# EAGLE design brewpi (EAGLE 7.1.0)
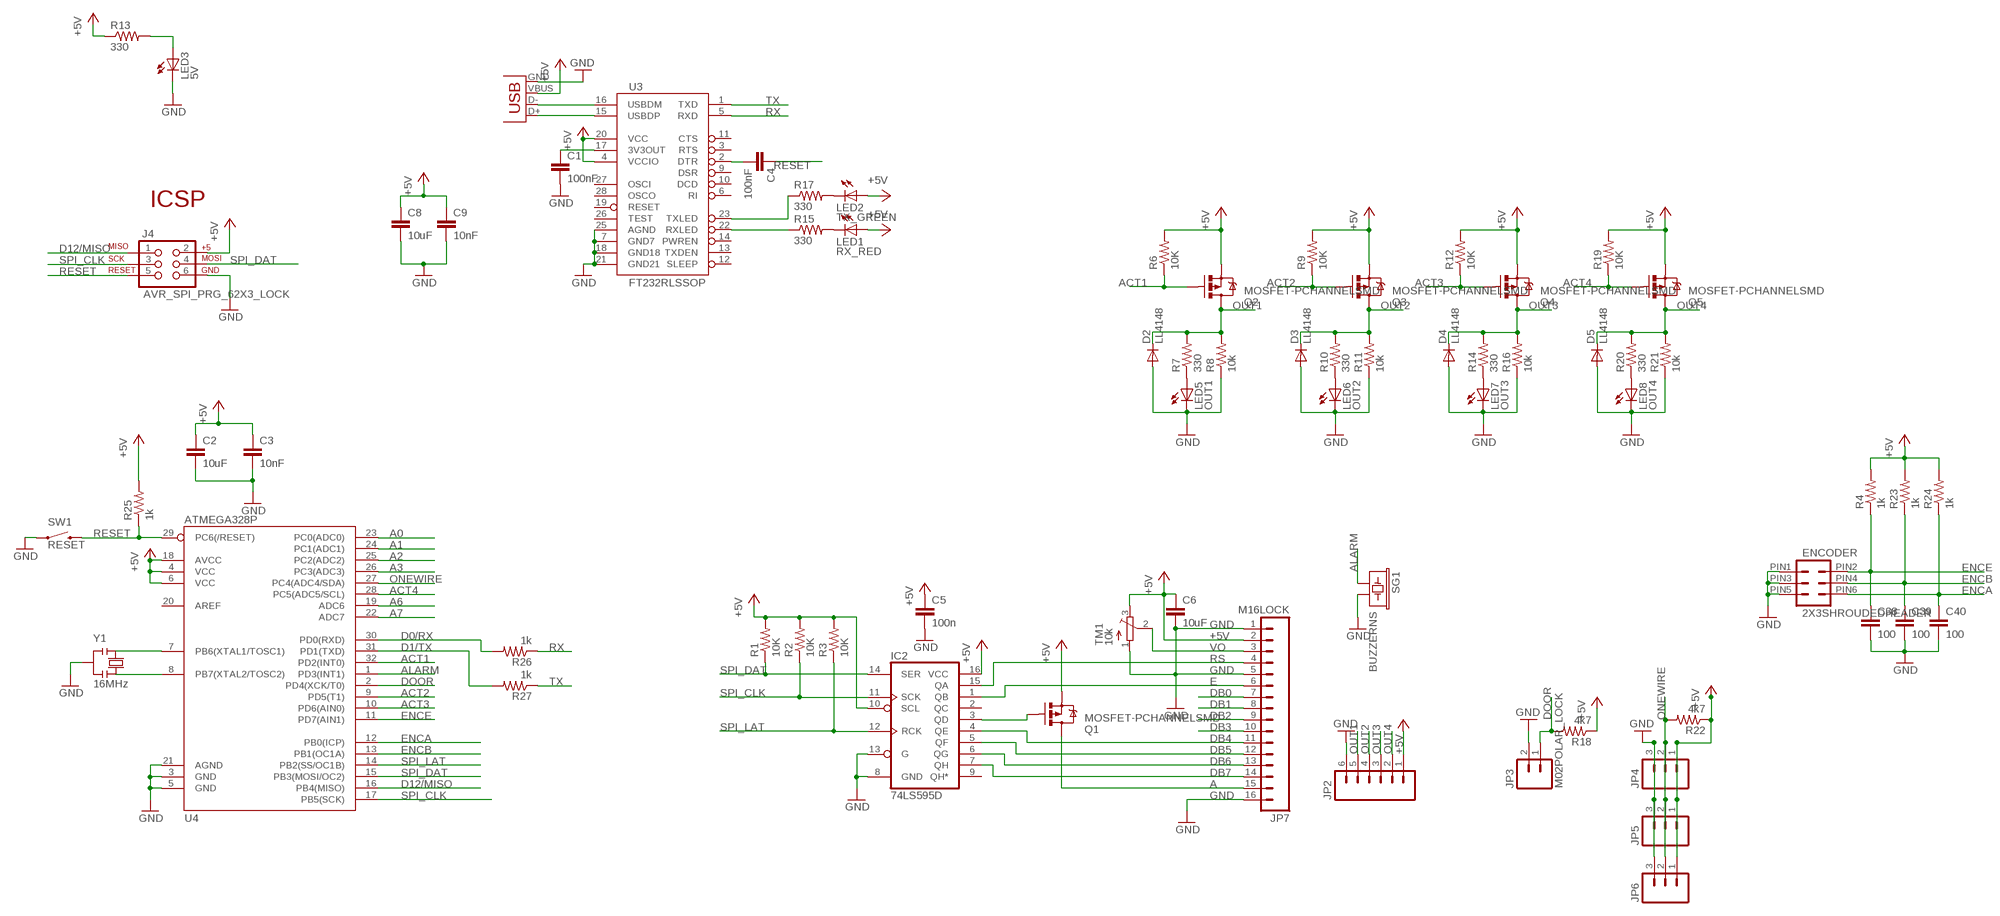
[diagram p0: schematic, sheet 1]

## Parts
C1  100nF  CAP0603-CAP  [0603-CAP]
C2  10uF  CAP0603-CAP  [0603-CAP]
C3  10nF  CAP0603-CAP  [0603-CAP]
C4  100nF  CAP0603-CAP  [0603-CAP]
C5  100n  CAP0603-CAP  [0603-CAP]
C6  10uF  CAP0603-CAP  [0603-CAP]
C8  10uF  CAP0603-CAP  [0603-CAP]
C9  10nF  CAP0603-CAP  [0603-CAP]
C38  100  CAP0603-CAP  [0603-CAP]
C39  100  CAP0603-CAP  [0603-CAP]
C40  100  CAP0603-CAP  [0603-CAP]
D2  LL4148  [MLL34]
D3  LL4148  [MLL34]
D4  LL4148  [MLL34]
D5  LL4148  [MLL34]
ENCODER  2X3SHROUDEDHEADER  [2X3SHROUDEDHEADER]
IC2  74LS595D  [SO16]
J4  AVR_SPI_PRG_62X3_LOCK  [2X3_LOCK]
JP1  USBSMD  [USB-MINIB]
JP2  M06POLAR_LOCK  [MOLEX-1X6_LOCK]
JP3  M02POLAR_LOCK  [MOLEX-1X2_LOCK]
JP4  M03POLAR_LOCK  [MOLEX-1X3_LOCK]
JP5  M03POLAR_LOCK  [MOLEX-1X3_LOCK]
JP6  M03POLAR_LOCK  [MOLEX-1X3_LOCK]
JP7  M16LOCK  [1X16_LOCK]
LED1  RX_RED  LED0603  [LED-0603]
LED2  TX_GREEN  LED0603  [LED-0603]
LED3  5V  LED0603  [LED-0603]
LED5  OUT1  LED0603  [LED-0603]
LED6  OUT2  LED0603  [LED-0603]
LED7  OUT3  LED0603  [LED-0603]
LED8  OUT4  LED0603  [LED-0603]
Q1  MOSFET-PCHANNELSMD  [SOT23-3]
Q2  MOSFET-PCHANNELSMD  [SOT23-3]
Q3  MOSFET-PCHANNELSMD  [SOT23-3]
Q4  MOSFET-PCHANNELSMD  [SOT23-3]
Q5  MOSFET-PCHANNELSMD  [SOT23-3]
R1  10K  RESISTOR0603-RES  [0603-RES]
R2  10K  RESISTOR0603-RES  [0603-RES]
R3  10K  RESISTOR0603-RES  [0603-RES]
R4  1k  R-US_R0603  [R0603]
R6  10K  RESISTOR0603-RES  [0603-RES]
R7  330  RESISTOR0603-RES  [0603-RES]
R8  10k  RESISTOR0603-RES  [0603-RES]
R9  10K  RESISTOR0603-RES  [0603-RES]
R10  330  RESISTOR0603-RES  [0603-RES]
R11  10k  RESISTOR0603-RES  [0603-RES]
R12  10K  RESISTOR0603-RES  [0603-RES]
R13  330  RESISTOR0603  [0603-RES]
R14  330  RESISTOR0603-RES  [0603-RES]
R15  330  RESISTOR0603  [0603-RES]
R16  10k  RESISTOR0603-RES  [0603-RES]
R17  330  RESISTOR0603  [0603-RES]
R18  4k7  RESISTOR0603-RES  [0603-RES]
R19  10K  RESISTOR0603-RES  [0603-RES]
R20  330  RESISTOR0603-RES  [0603-RES]
R21  10k  RESISTOR0603-RES  [0603-RES]
R22  4k7  RESISTOR0603-RES  [0603-RES]
R23  1k  R-US_R0603  [R0603]
R24  1k  R-US_R0603  [R0603]
R25  1k  RESISTOR0603  [0603-RES]
R26  1k  RESISTOR0603  [0603-RES]
R27  1k  RESISTOR0603  [0603-RES]
SG1  BUZZERNS  [BUZZER-12MM-NS]
SW1  RESET  SWITCH-MOMENTARY-2SMD-4  [TACTILE_SWITCH_TALL]
TM1  10k  TRIMPOTTC33X  [TC33X]
U3  FT232RLSSOP  [SSOP28DB]
U4  ATMEGA328P  ATMEGA328_SMT  [TQFP32-08]
Y1  16MHz  RESONATORMU  [RESONATOR]

## Nets
+5V: C2.1 C3.1 C5.1 C6.1 C8.1 C9.1 IC2.10(SCL) IC2.16(VCC) J4.2 JP1.VBUS JP2.1 JP4.1 JP5.1 JP6.1 JP7.2 LED1.A LED2.A Q1.2(S) Q2.2(S) Q3.2(S) Q4.2(S) Q5.2(S) R1.2 R2.2 R3.2 R4.2 R6.2 R9.2 R12.2 R13.1 R18.1 R19.2 R22.1 R23.2 R24.2 R25.2 TM1.3(E) U3.4(VCCIO) U3.20(VCC) U4.4(VCC) U4.6(VCC) U4.18(AVCC)
A: JP7.15 Q1.3(D)
A0: U4.23(PC0(ADC0))
A1: U4.24(PC1(ADC1))
A2: U4.25(PC2(ADC2))
A3: U4.26(PC3(ADC3))
A6: U4.19(ADC6)
A7: U4.22(ADC7)
ACT1: Q2.1(G) R6.1 U4.32(PD2(INT0))
ACT2: Q3.1(G) R9.1 U4.9(PD5(T1))
ACT3: Q4.1(G) R12.1 U4.10(PD6(AIN0))
ACT4: Q5.1(G) R19.1 U4.28(PC5(ADC5/SCL))
ALARM: SG1.+ U4.1(PD3(INT1))
D0/RX: R26.2 U4.30(PD0(RXD))
D1/TX: R27.2 U4.31(PD1(TXD))
D12/MISO: J4.1 U4.16(PB4(MISO))
D_M: JP1.D- U3.16(USBDM)
D_P: JP1.D+ U3.15(USBDP)
DB0: JP7.7
DB1: JP7.8
DB2: JP7.9
DB3: JP7.10
DB4: IC2.4(QE) JP7.11
DB5: IC2.5(QF) JP7.12
DB6: IC2.6(QG) JP7.13
DB7: IC2.7(QH) JP7.14
DOOR: JP3.1 R18.2 U4.2(PD4(XCK/T0))
E: IC2.1(QB) JP7.6
ENCA: C40.1 ENCODER.PIN6 R24.1 U4.12(PB0(ICP))
ENCB: C39.1 ENCODER.PIN4 R23.1 U4.13(PB1(OC1A))
ENCE: C38.1 ENCODER.PIN2 R4.1 U4.11(PD7(AIN1))
GND: C1.2 C2.2 C3.2 C5.2 C6.2 C8.2 C9.2 C38.2 C39.2 C40.2 D2.A D3.A D4.A D5.A ENCODER.PIN1 ENCODER.PIN3 ENCODER.PIN5 IC2.8(GND) IC2.13(G) J4.6 JP1.GND JP2.6 JP3.2 JP4.3 JP5.3 JP6.3 JP7.1 JP7.5 JP7.16 LED3.C LED5.C LED6.C LED7.C LED8.C R8.1 R11.1 R16.1 R21.1 SG1.- SW1.A2 TM1.1(A) U3.7(GND7) U3.18(GND18) U3.21(GND21) U3.25(AGND) U4.3(GND) U4.5(GND) U4.21(AGND) Y1.2
N$1: U4.7(PB6(XTAL1/TOSC1)) Y1.1
N$2: U4.8(PB7(XTAL2/TOSC2)) Y1.3
N$3: LED3.A R13.2
N$4: C4.2 U3.2(DTR)
N$5: IC2.3(QD) Q1.1(G)
N$7: LED1.C R15.2
N$8: R15.1 U3.22(RXLED)
N$9: R17.1 U3.23(TXLED)
N$10: LED2.C R17.2
N$35: LED5.A R7.1
N$36: LED6.A R10.1
N$37: LED7.A R14.1
N$38: LED8.A R20.1
N$39: C1.1 U3.17(3V3OUT)
ONEWIRE: JP4.2 JP5.2 JP6.2 R22.2 U4.27(PC4(ADC4/SDA))
OUT1: D2.C JP2.5 Q2.3(D) R7.2 R8.2
OUT2: D3.C JP2.4 Q3.3(D) R10.2 R11.2
OUT3: D4.C JP2.3 Q4.3(D) R14.2 R16.2
OUT4: D5.C JP2.2 Q5.3(D) R20.2 R21.2
RESET: C4.1 J4.5 R25.1 SW1.B2 U4.29(PC6(/RESET))
RS: IC2.15(QA) JP7.4
RX: R26.1 U3.5(RXD)
SPI_CLK: IC2.11(SCK) J4.3 R2.1 U4.17(PB5(SCK))
SPI_DAT: IC2.14(SER) J4.4 R1.1 U4.15(PB3(MOSI/OC2))
SPI_LAT: IC2.12(RCK) R3.1 U4.14(PB2(SS/OC1B))
TX: R27.1 U3.1(TXD)
VO: JP7.3 TM1.2(S)
Unconnected: IC2.2(QC) IC2.9(QH*) U3.3(RTS) U3.6(RI) U3.9(DSR) U3.10(DCD) U3.11(CTS) U3.12(SLEEP) U3.13(TXDEN) U3.14(PWREN) U3.19(RESET) U3.26(TEST) U3.27(OSCI) U3.28(OSCO) U4.20(AREF)

## Notes on the sheet
- ICSP

## Library data of the parts
C1-C6 C8 C9 = SparkFun-Capacitors:CAP: Capacitor Standard 0603 ceramic capacitor, and 0.1" leaded capacitor.
C38-C40 = SparkFun:CAP: Capacitor Standard 0603 ceramic capacitor, and 0.1" leaded capacitor.
D2-D5 = Discrete:LL4148
ENCODER = personal:2X3SHROUDEDHEADER
IC2 = SparkFun-DigitalIC:74*595: 8-bit SHIFT REGISTER, output latch
J4 = SparkFun-Connectors:AVR_SPI_PRG_6: AVR ISP 6 Pin This is the reduced ISP connector for AVR programming. Common on Arduino. This footprint will take up less PCB space and can be used with a 10-pin to 6-pin adapter such as SKU: BOB-08508
JP1 = SparkFun-Connectors:USB: USB Connectors USB-B-PTH is fully proven SKU : PRT-00139/CONN-08278 USB-miniB is fully proven SKU : PRT-00587 USB-A-PCB is untested. USB-A-H is throughly reviewed, but untested. Spark Fun Electronics SKU : PRT-00437 USB-B-SMT is throughly reviewed, but untested. Needs silkscreen touching up. USB-A-S has not been used/tested USB-MB-H has not been used/tested USB-MICROB has been used. CONN-09505; PROD_ID: CONN-08193
JP2 = SparkFun-Connectors:M06: Header 6 Standard 6-pin 0.1" header. Use with straight break away headers (SKU : PRT-00116), right angle break away headers (PRT-00553), swiss pins (PRT-00743), machine pins (PRT-00117), and female headers (PRT-00115). Molex polarized connector foot print use with SKU : PRT-08094 with associated crimp pins and housings. NOTES ON THE VARIANTS LOCK and LOCK_LONGPADS... This footprint was designed to help hold the alignment of a through-hole component (i.e. 6-pin header) while soldering it into place. You may notice that each hole has been shifted either up or down by 0.005 of an inch from it's more standard position (which is a perfectly straight line). This slight alteration caused the pins (the squares in the middle) to touch the edges of the holes. Because they are alternating, it causes a "brace" to hold the component in place. 0.005 has proven to be the perfect amount of "off-center" position when using our standard breakaway headers. Although looks a little odd when you look at the bare footprint, once you have a header in there, the alteration is very hard to notice. Also,if you push a header all the way into place, it is covered up entirely on the bottom side. This idea of altering the position of holes to aid alignment will be further integrated into the Sparkfun Library for other footprints. It can help hold any component with 3 or more connection pins.
JP3 = SparkFun-Connectors:M02: Standard 2-pin 0.1" header. Use with - straight break away headers ( PRT-00116) - right angle break away headers (PRT-00553) - swiss pins (PRT-00743) - machine pins (PRT-00117) - female headers (PRT-00115) Molex polarized connector foot print use with: PRT-08233 with associated crimp pins and housings. 2.54_SCREWTERM for use with PRT-10571. 3.5mm Screw Terminal footprints for PRT-08084 5mm Screw Terminal footprints for use with PRT-08433
JP4-JP6 = SparkFun-Connectors:M03: Header 3 Standard 3-pin 0.1" header. Use with straight break away headers (SKU : PRT-00116), right angle break away headers (PRT-00553), swiss pins (PRT-00743), machine pins (PRT-00117), and female headers (PRT-00115). Molex polarized connector foot print use with SKU : PRT-08232 with associated crimp pins and housings.
JP7 = SparkFun-Connectors:M16: 1x16 .1" header
LED1-LED3 LED5-LED8 = SparkFun-LED:LED: LEDs Standard schematic elements and footprints for 5mm, 3mm, 1206, and 0603 sized LEDs. 5mm - Spark Fun Electronics SKU : COM-00529 (and others)
Q1-Q5 = SparkFun-DiscreteSemi:MOSFET-PCHANNEL: Generic PMOSFET
R1-R3 R6-R22 R25-R27 = SparkFun-Resistors:RESISTOR: Resistor Basic schematic elements and footprints for 0603, 1206, and PTH resistors.
R4 R23 R24 = rcl:R-US_: RESISTOR, American symbol
SG1 = SparkFun-Electromechanical:BUZZER: Buzzer 12mm Spark Fun Electronics SKU : Comp-Buzzer
SW1 = SparkFun-Electromechanical:SWITCH-MOMENTARY-2: Various NO switches- pushbuttons, reed, etc
TM1 = adafruit:TRIMPOT: SMT trimmer potentiometer part number TC33X http://www.ladyada.net/library/eagle
U3 = SparkFun-DigitalIC:FT232RL: USB UART FT232RL 4th Generation USB UART (USB <-> Serial) Controller. Spark Fun Electronics SKU : COM-00650 Production SKU IC-00870; PROD_ID: IC-00870
U4 = SparkFun-DigitalIC:ATMEGA328_SMT: 32-Pin Atmega328 part Commonly used on Arduino compatible boards Available in QFP and QFN packages TQFP is IC-09069 QFN is non-stock; PROD_ID: IC-09069
Y1 = MySMD2:RESONATOR

## Board
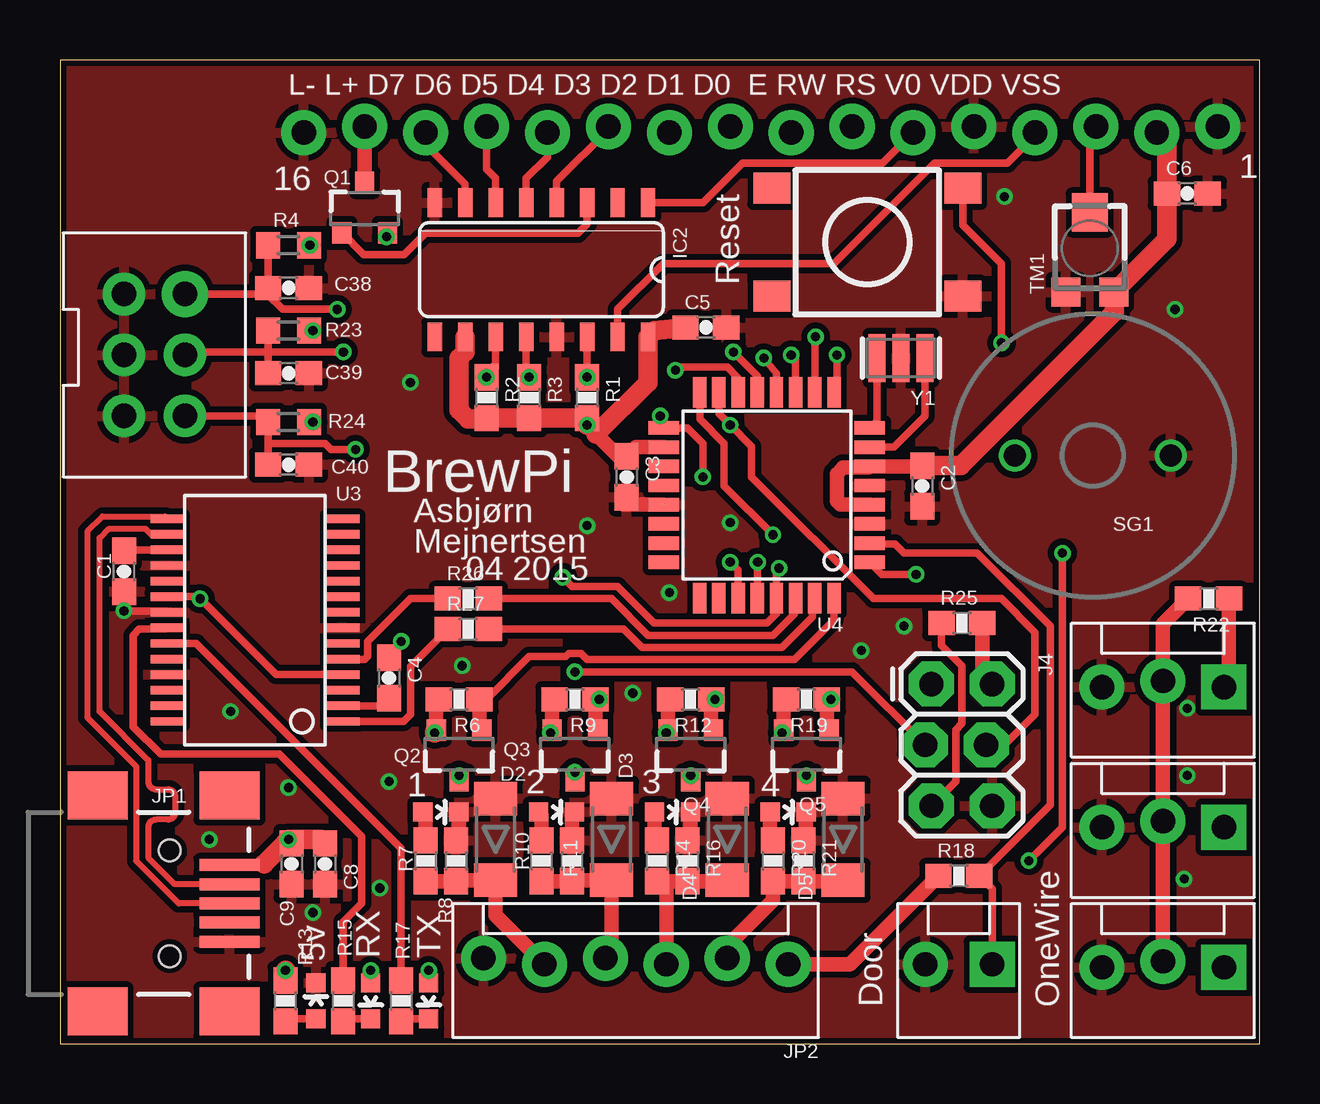
[diagram p1: board, top side]
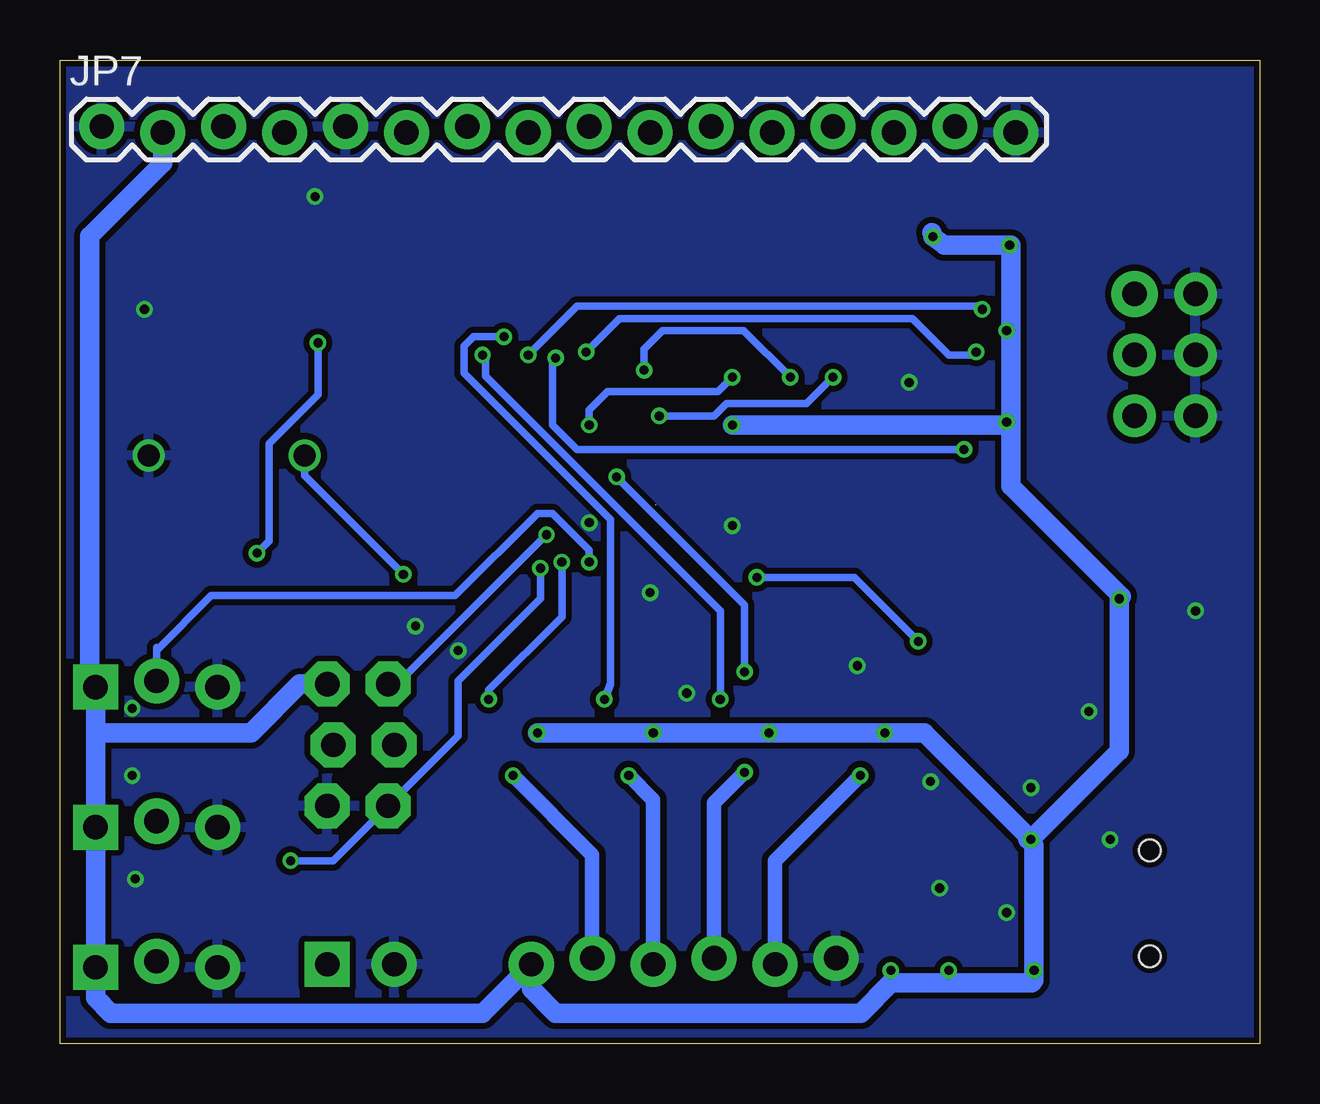
[diagram p2: board, bottom side, seen from below]

Size 50 x 41 mm. Coordinates in mm from the lower left corner, seen from the top.
Outline: 0,41 0,0 50,0 50,41 0,41
Copper layers (1*2*15*16): Top 0.035mm / dielectric 0.2mm / Route2 0.0175mm / dielectric 1.1mm / Route15 0.0175mm / dielectric 0.2mm / Bottom 0.035mm
Design rules "SeeedStudio_DRU_no_angle_20130527": minimum track width 6mil, minimum drill 12mil, track to track 6mil, track to pad 6mil, pad to pad 6mil, via to via 6mil, smd to smd 0mil, copper to edge 10mil, drill to drill 10mil, minimum pad ring 6mil, minimum via ring 6mil, stop-mask expansion 2mil, vias tented up to drill 25mil, thermal gap 10mil

### Footprints (pad centres in the part's own frame; a part is rotated, then mirrored left to right if it is on the bottom)
0603-CAP = smd 1.1 x 1: 1 -0.85,0; 2 0.85,0
MLL34 = smd 1.4 x 1.8: A 1.7,0; C -1.7,0
2X3SHROUDEDHEADER = drill 1.02 pad 1.778: PIN1 0,2.54; PIN3 2.54,2.54; PIN4 2.54,5.08; PIN5 5.08,2.54; PIN6 5.08,5.08 | drill 1.02 pad 1.93: PIN2 0,5.08
SO16 = smd 0.6 x 1.2: 1 -4.445,-2.8; 2 -3.175,-2.8; 3 -1.905,-2.8; 4 -0.635,-2.8; 5 0.635,-2.8; 6 1.905,-2.8; 7 3.175,-2.8; 8 4.445,-2.8; 9 4.445,2.8; 10 3.175,2.8; 11 1.905,2.8; 12 0.635,2.8; 13 -0.635,2.8; 14 -1.905,2.8; 15 -3.175,2.8; 16 -4.445,2.8
2X3_LOCK = drill 1.016 pad 1.88 octagon: 1 0,0; 2 0,2.54; 3 2.54,-0.254; 4 2.54,2.286; 5 5.08,0; 6 5.08,2.54
USB-MINIB = smd 2.5 x 0.5: D+ 2.5,0; D- 2.5,0.8; GND 2.5,-1.6; ID 2.5,-0.8; VBUS 2.5,1.6 | smd 2.5 x 2: MTN1 -3,4.5; MTN2 2.5,4.5; MTN3 -3,-4.5; MTN4 2.5,-4.5 | hole 0.9: 0,2.2; 0,-2.2
MOLEX-1X6_LOCK = drill 1.016 pad 1.88: 1 0,0; 2 2.54,-0.254; 3 5.08,0; 4 7.62,-0.254; 5 10.16,0; 6 12.7,-0.254
MOLEX-1X2_LOCK = drill 1.016 pad 1.88 square: 1 -0.127,0 | drill 1.016 pad 1.88: 2 2.667,0
MOLEX-1X3_LOCK = drill 1.016 pad 1.88 square: 1 0,0.127 | drill 1.016 pad 1.88: 2 2.54,-0.127; 3 5.08,0.127
1X16_LOCK = drill 1.016 pad 1.88: 1 0,0.127; 2 2.54,-0.127; 3 5.08,0.127; 4 7.62,-0.127; 5 10.16,0.127; 6 12.7,-0.127; 7 15.24,0.127; 8 17.78,-0.127; 9 20.32,0.127; 10 22.86,-0.127; 11 25.4,0.127; 12 27.94,-0.127; 13 30.48,0.127; 14 33.02,-0.127; 15 35.56,0.127; 16 38.1,-0.127
LED-0603 = smd 0.8 x 0.8: A 0,-0.75; C 0,0.75
SOT23-3 = smd 0.8 x 0.9: 1 -0.95,-1; 2 0.95,-1; 3 0,1.1
0603-RES = smd 1.1 x 1: 1 -0.85,0; 2 0.85,0
R0603 = smd 1 x 1.1: 1 -0.85,0; 2 0.85,0
BUZZER-12MM-NS = drill 0.9: + 3.25,0; - -3.25,0
TACTILE_SWITCH_TALL = smd 1.55 x 1.3: A1 -3.975,-2.25; A2 3.975,-2.25; B1 -3.975,2.25; B2 3.975,2.25
TC33X = smd 1.2 x 1.2: 1 -1,-1.825; 3 1,-1.825 | smd 1.5 x 1.6: 2 0,1.5
SSOP28DB = smd 0.348 x 1.397: 1 -4.225,-3.656; 2 -3.575,-3.656; 3 -2.925,-3.656; 4 -2.275,-3.656; 5 -1.625,-3.656; 6 -0.975,-3.656; 7 -0.325,-3.656; 8 0.325,-3.656; 9 0.975,-3.656; 10 1.625,-3.656; 11 2.275,-3.656; 12 2.925,-3.656; 13 3.575,-3.656; 14 4.225,-3.656; 15 4.225,3.656; 16 3.575,3.656; 17 2.925,3.656; 18 2.275,3.656; 19 1.625,3.656; 20 0.975,3.656; 21 0.325,3.656; 22 -0.325,3.656; 23 -0.975,3.656; 24 -1.625,3.656; 25 -2.275,3.656; 26 -2.925,3.656; 27 -3.575,3.656; 28 -4.225,3.656
TQFP32-08 = smd 1.27 x 0.559: 1 -4.293,2.8; 2 -4.293,2; 3 -4.293,1.2; 4 -4.293,0.4; 5 -4.293,-0.4; 6 -4.293,-1.2; 7 -4.293,-2; 8 -4.293,-2.8; 17 4.293,-2.8; 18 4.293,-2; 19 4.293,-1.2; 20 4.293,-0.4; 21 4.293,0.4; 22 4.293,1.2; 23 4.293,2; 24 4.293,2.8 | smd 0.559 x 1.27: 9 -2.8,-4.293; 10 -2,-4.293; 11 -1.2,-4.293; 12 -0.4,-4.293; 13 0.4,-4.293; 14 1.2,-4.293; 15 2,-4.293; 16 2.8,-4.293; 25 2.8,4.293; 26 2,4.293; 27 1.2,4.293; 28 0.4,4.293; 29 -0.4,4.293; 30 -1.2,4.293; 31 -2,4.293; 32 -2.8,4.293
RESONATOR = smd 0.7 x 2: 1 -1,0; 2 0,0; 3 1,0

### Placement (x,y rotation side)
C1  2.67,19.68 270 top
C2  35.94,23.24 270 top
C3  23.62,23.62 270 top
C4  13.72,15.24 270 top
C5  26.92,29.84 0 top
C6  46.99,35.43 0 top
C8  11.05,7.49 270 top
C9  9.65,7.49 270 top
C38  9.53,31.5 0 top
C39  9.53,27.94 0 top
C40  9.53,24.13 0 top
D2  18.16,8.51 90 top
D3  22.99,8.51 90 top
D4  27.81,8.51 90 top
D5  32.64,8.51 90 top
ENCODER  0.13,31.24 270 top
IC2  20.07,32.26 180 top
J4  36.32,14.99 270 top
JP1  4.57,5.84 0 top
JP2  30.35,3.3 180 top
JP3  38.73,3.3 180 top
JP4  48.51,3.3 180 top
JP5  48.51,9.14 180 top
JP6  48.51,14.99 180 top
JP7  48.26,38.1 0 bottom
LED1  12.95,1.78 180 top
LED2  15.37,1.78 180 top
LED3  10.67,1.78 0 top
LED5  15.88,9.65 270 top
LED6  20.7,9.65 270 top
LED7  25.53,9.65 270 top
LED8  30.35,9.65 270 top
Q1  12.7,34.8 0 top
Q2  16.64,12.06 180 top
Q3  21.46,12.06 180 top
Q4  26.29,12.06 180 top
Q5  31.11,12.06 180 top
R1  21.97,26.92 270 top
R2  17.78,26.92 270 top
R3  19.56,26.92 270 top
R4  9.53,33.27 0 top
R6  16.64,14.35 180 top
R7  15.24,7.62 270 top
R8  16.51,7.62 270 top
R9  21.46,14.35 180 top
R10  20.07,7.62 270 top
R11  21.34,7.62 270 top
R12  26.29,14.35 180 top
R13  9.4,1.78 270 top
R14  24.89,7.62 270 top
R15  11.81,1.78 270 top
R16  26.16,7.62 270 top
R17  14.22,1.78 270 top
R18  37.47,6.99 0 top
R19  31.11,14.35 180 top
R20  29.72,7.62 270 top
R21  30.99,7.62 270 top
R22  47.88,18.54 180 top
R23  9.53,29.72 0 top
R24  9.53,25.91 0 top
R25  37.59,17.53 0 top
R26  17.02,18.54 0 top
R27  17.02,17.27 0 top
SG1  43.05,24.51 180 top
SW1  33.66,33.4 0 top
TM1  42.93,33.15 0 top
U3  8.13,17.65 90 top
U4  29.46,22.86 180 top
Y1  35.05,28.57 180 top

### Tracks (layer width: path | path; a pad name or v marks a point on that pad's centre or on a via)
+5V  (via drill 0.38)
  Top 0.254: Q1.2 13.61,33.8 13.59,33.78 13.74,33.76 v13.61,33.63 | v10.41,33.27 R4.2 | 10.38,29.59 R23.2 v10.54,29.72 | R24.2 v10.54,25.91
  Top 0.305: v30.1,12.95 30.1,13 Q5.2 | v25.27,12.95 25.27,13 Q4.2 | v20.45,12.95 20.45,13 Q3.2 | U3.20 5.76,18.63 v5.84,18.54 9.01,15.38 U3.4
  Top 0.406: 8.38,7.49 7.12,7.49 JP1.VBUS
  Top 0.61: C9.1 9.23,8.34 8.38,7.49 | LED1.A v12.95,3.05 | v15.37,3.05 LED2.A | R6.2 15.69,14.25 Q2.2 | R9.2 20.51,14.25 Q3.2 | R12.2 25.34,14.25 Q4.2 | R19.2 30.16,14.25 Q5.2 | R18.1 32.93,3.3 JP2.1 | R25.2 38.44,15.41 J4.2 | v21.97,25.78 22.35,25.4 23.28,24.47 C3.1 24.01,24.86 U4.18 | C2.1 35.91,24.06 U4.6 33.7,24 32.64,24 32.38,23.75 32.38,22.61 32.53,22.46 U4.4 | R22.1 48.73,15.07 JP6.1
  Top 0.813: C9.1 9.36,8.34 | 9.36,8.34 8.51,7.49 | 9.36,8.34 v9.53,8.51 10.88,8.51 C8.1 | R13.1 v9.4,3.05 | JP7.2 46.14,37.55 C6.1 46.14,33.54 TM1.3 43.94,31.31 43.94,30.48 37.55,24.09 C2.1 | IC2.10 16.89,28.83 16.64,28.57 16.64,26.42 17.02,26.04 17.74,26.04 R2.2 R3.2 R1.2 v21.97,25.78 | C5.1 24.77,29.72 IC2.16 24.51,27.56 22.35,25.4 | Q2.2 15.62,13 v15.62,12.95
  Bottom 0.254: v10.54,29.72 10.76,29.72 10.38,30.1 | v10.54,25.91 R24.2
  Bottom 0.305: 5.76,18.63 v5.84,18.54
  Bottom 0.61: v12.95,3.05 LED1.A | LED2.A v15.37,3.05
  Bottom 0.813: v9.53,8.51 9.65,8.51 9.4,8.26 v9.4,3.05 R13.1 9.5,2.53 LED1.A LED2.A 16.62,1.27 29.34,1.27 30.35,2.29 JP2.1 32.38,1.27 47.88,1.27 48.51,1.91 JP4.1 JP5.1 48.51,13.21 | 48.51,13.21 JP6.1 48.77,15.11 48.77,33.66 45.72,36.7 JP7.2 | v21.97,25.78 10.5,25.78 R24.2 | R24.2 10.38,30.1 R4.2 v10.41,33.27 13.13,33.27 v13.61,33.63 Q1.2 | v9.53,8.51 13.97,12.95 v15.62,12.95 v20.45,12.95 v25.27,12.95 v30.1,12.95 | v5.84,18.54 5.84,12.19 v9.53,8.51 | 5.76,18.63 10.38,23.25 R24.2 | J4.2 40.01,14.99 42.04,12.95 48.26,12.95 48.51,13.21
A
  Top 0.61: Q1.3 JP7.15
ACT1
  Top 0.305: R6.1 17.78,14.35 19.56,16.13 21.08,16.13 21.21,16.26 21.72,16.26 21.97,16 30.61,16 30.73,16.13 30.92,16.32 32.26,17.65 U4.32
  Top 0.61: Q2.1 17.49,13.16 R6.1
ACT2  (via drill 0.38)
  Top 0.305: R9.1 v22.48,14.35 | v32.38,28.7 32.38,27.4 U4.9
  Top 0.61: Q3.1 22.31,13.16 R9.1
  Bottom 0.305: v32.38,28.7 32.26,28.45 32.26,27.81 22.48,18.03 v22.48,14.35
ACT3  (via drill 0.38)
  Top 0.305: U4.10 31.46,29.43 v31.5,29.46 | v27.3,14.35 R12.1
  Top 0.61: Q4.1 27.14,13.16 R12.1
  Bottom 0.305: v31.5,29.46 32.77,29.46 33.15,29.08 33.15,27.94 27.05,21.84 27.05,14.99 v27.3,14.35
ACT4  (via drill 0.38)
  Top 0.305: R19.1 v32.13,14.35 | v29.08,20.07 29.08,18.59 U4.28
  Top 0.61: Q5.1 31.96,13.16 R19.1
  Bottom 0.305: v32.13,14.35 32.13,14.73 29.08,17.78 v29.08,20.07
ALARM  (via drill 0.38)
  Top 0.305: U4.1 34.26,19.56 v35.69,19.56
  Bottom 0.305: v35.69,19.56 39.8,23.67 SG1.+
D0/RX
  Top 0.305: R26.2 22.99,18.54 24.51,17.02 29.72,17.02 30.61,17.91 30.61,18.51 U4.30
D1/TX
  Top 0.305: R27.2 23.5,17.27 24.26,16.51 30.1,16.51 31.37,17.78 31.37,18.47 U4.31
D12/MISO  (via drill 0.38)
  Top 0.305: v29.72,21.21 27.69,23.24 27.69,25.02 26.67,26.04 U4.16
  Bottom 0.305: J4.1 35.94,14.99 v29.72,21.21
D_M
  Top 0.254: JP1.D- 4.79,6.64 3.68,7.75 3.68,9.02 arc-90 4,9.34 4.49,9.34 arc90 4.81,9.65 4.81,10.28 arc90 4.49,10.6 4,10.6 arc-90 3.68,10.91 3.68,11.81 1.65,13.84 1.65,21.08 2.03,21.46 3.56,21.46 3.81,21.21 4.45,21.21 U3.16
D_P
  Top 0.254: JP1.D+ 4.95,5.84 3.17,7.62 3.17,11.56 1.14,13.59 1.14,21.34 1.78,21.97 4.38,21.97 U3.15
DB4
  Top 0.305: JP7.11 22.86,38.1 20.7,35.94 IC2.4
DB5
  Top 0.305: JP7.12 20.32,36.96 19.43,36.07 IC2.5
DB6
  Top 0.305: JP7.13 17.78,36.45 18.16,36.07 IC2.6
DB7
  Top 0.305: JP7.14 15.24,37.47 16.89,35.81 IC2.7
DOOR
  Top 0.305: JP3.1 38.86,6.44 R18.2 41.27,9.95 41.27,17.4 38.23,20.45 35.18,20.45 34.8,20.83 33.79,20.83 U4.2
E
  Top 0.305: IC2.1 26.8,35.06 28.45,36.7 34.29,36.7 JP7.6
ENCA  (via drill 0.38)
  Top 0.305: ENCODER.PIN6 8.42,26.16 R24.1 | R24.1 8.68,25.02 | 8.68,25.02 C40.1 | U4.12 29.86,27.92 v29.34,28.57 | v12.32,24.77 11.3,24.77 11.05,25.02 8.68,25.02 | R24.1 8.68,26 8.64,26.04
  Bottom 0.305: v12.32,24.77 28.45,24.77 29.46,25.78 29.46,28.45 v29.34,28.57
ENCB  (via drill 0.38)
  Top 0.305: U4.13 29.06,27.83 28.57,28.32 v28.07,28.83 | R23.1 C39.1 8.68,28.79 8.64,28.83 | v11.81,28.83 8.64,28.83 | 8.64,28.83 5.33,28.83 ENCODER.PIN4
  Bottom 0.305: v11.81,28.83 11.94,28.7 12.95,28.7 14.48,30.23 26.67,30.23 v28.07,28.83
ENCE  (via drill 0.38)
  Top 0.305: ENCODER.PIN2 8.42,31.24 C38.1 | C38.1 R4.1 | U4.11 30.66,28.52 v30.48,28.7 | v11.56,30.61 9.27,30.61 8.68,31.2 C38.1
  Bottom 0.305: v30.48,28.7 28.45,30.73 11.81,30.73 11.68,30.61 v11.56,30.61
GND  (via drill 0.38)  (1 unrouted)
  Top 0.305: U3.21 4.42,18.03 v2.67,18.03
  Top 0.61: LED5.C 16.62,8.59 R8.1 | R11.1 21.34,9.54 LED6.C | LED7.C 26.28,8.59 R16.1 | LED8.C 31.1,8.59 R21.1 | 25.15,22.48 23.5,22.48
  other vias: 7.11,13.84 10.54,5.46 13.72,10.92 39.37,35.31 46.48,30.61 23.88,14.61 46.99,11.18 14.61,27.56 46.99,13.97 35.18,17.4 33.4,16.38 16.76,15.75 9.53,10.67 6.22,8.51 13.34,6.48 46.86,6.86 25.4,18.8 21.97,21.59 27.94,21.72
  pour Bottom (isolate 0.254): 0,0 50,0 50,41 0,41
  pour Top (isolate 0.254): 0,0 50,0 50,41 0,41
N$1
  Top 0.305: U4.7 34.77,24.86 36.05,26.15 Y1.1
N$2
  Top 0.305: Y1.3 34.05,25.95 U4.8
N$3
  Top 0.305: LED3.A 9.5,1.03 R13.2
N$4
  Top 0.305: U3.2 13.4,14.08 C4.2
N$5
  Top 0.305: IC2.3 21.97,34.16 21.59,33.78 15.24,33.78 14.35,32.89 12.65,32.89 Q1.1
N$7
  Top 0.305: LED1.C 11.91,1.03 R15.2
N$8
  Top 0.305: R15.1 11.81,5.08 12.57,5.84 12.57,8.64 9.14,12.06 4.19,12.06 3.05,13.21 3.05,17.02 3.3,17.27 4.42,17.27 U3.22
N$9
  Top 0.305: U3.23 5.67,16.68 14.22,8.13 R17.1
N$10
  Top 0.305: LED2.C 14.32,1.03 R17.2
N$35
  Top 0.61: R7.1 15.24,9.54 LED5.A
N$36
  Top 0.61: R10.1 20.07,9.54 LED6.A
N$37
  Top 0.61: LED7.A 24.78,8.59 R14.1
N$38
  Top 0.61: LED8.A 29.6,8.59 R20.1
N$39
  Top 0.305: C1.1 2.71,20.58 U3.17
ONEWIRE  (via drill 0.38)
  Top 0.305: U4.27 28.26,19.74 v27.94,20.07
  Top 0.61: JP4.2 JP5.2 JP6.2 45.97,17.49 R22.2
  Bottom 0.305: v27.94,20.07 27.94,20.57 29.46,22.1 30.1,22.1 33.53,18.67 43.69,18.67 45.97,16.38 JP6.2 45.97,16.51
OUT1  (via drill 0.38)
  Top 0.61: JP2.5 18.16,5.33 D2.C 16.55,6.81 R8.2 R7.2 | Q2.3 v16.64,11.18
  Bottom 0.61: v16.64,11.18 20.19,7.62 JP2.5
OUT2  (via drill 0.38)
  Top 0.61: JP2.4 22.99,3.81 D3.C 21.38,6.81 R11.2 R10.2 | Q3.3 v21.46,11.3
  Bottom 0.61: v21.46,11.3 22.73,10.03 JP2.4
OUT3  (via drill 0.38)
  Top 0.61: JP2.3 25.27,6.39 R14.2 R16.2 27.77,6.77 D4.C | Q4.3 v26.29,11.18
  Bottom 0.61: v26.29,11.18 25.27,10.16 JP2.3
OUT4  (via drill 0.38)
  Top 0.61: JP2.2 27.81,4.06 29.72,5.97 R20.2 R21.2 32.6,6.77 D5.C | Q5.3 v31.11,11.18
  Bottom 0.61: v31.11,11.18 27.81,7.87 JP2.2
RESET  (via drill 0.38)
  Top 0.305: C4.1 14.22,16.6 v14.22,16.76 | v20.95,19.43 21.34,19.05 23.24,19.05 24.77,17.53 29.46,17.53 29.86,17.93 U4.29 29.86,19.7 v29.97,19.81 | R25.1 36.74,16.6 37.59,15.75 37.59,13.34 37.34,13.08 37.34,10.92 J4.5 | SW1.B2 37.63,34.12 39.24,32.51 v39.24,29.21 | v41.78,20.45 41.78,9.02 v40.39,7.62
  Bottom 0.305: v14.22,16.76 16.89,19.43 v20.95,19.43 | v29.97,19.81 29.97,18.54 33.4,15.11 33.4,12.83 J4.5 38.61,7.62 v40.39,7.62 | v39.24,29.21 39.24,27.05 41.27,25.02 41.27,20.95 v41.78,20.45
RS
  Top 0.305: JP7.4 40.64,37.85 39.5,36.7 36.45,36.7 32.26,32.51 25.15,32.51 23.24,30.61 IC2.15
RX
  Top 0.305: R26.1 14.61,18.54 12.83,16.76 12.83,16.13 12.7,16 11.81,16 U3.5
SPI_CLK  (via drill 0.38)
  Top 0.305: 18.16,28.32 18.16,28.16 R2.1 17.78,27.94 18.16,28.32 | 18.16,28.32 IC2.11 | v25.02,26.16 25.17,26.01 U4.17 26.16,25.65 26.8,25.02 v26.8,23.62 | 35.94,12.45 J4.3 33.02,15.49 v21.46,15.49
  Bottom 0.305: v25.02,26.16 22.73,26.16 22.23,26.67 18.88,26.67 R2.1 | v21.46,15.49 21.46,18.29 v26.8,23.62
  other vias: 17.78,27.77
SPI_DAT  (via drill 0.38)
  Top 0.305: R1.1 IC2.14 | U4.15 27.46,26.26 v27.94,25.78 28.83,24.89 28.83,23.62 33.91,18.54 39.24,18.54 40.64,17.14 40.64,13.72 39.37,12.45 J4.4
  Bottom 0.305: v27.94,25.78 27.94,26.42 27.18,27.18 22.57,27.18 R1.1
  other vias: 21.97,27.77
SPI_LAT  (via drill 0.38)
  Top 0.305: IC2.12 19.43,27.9 R3.1 19.9,27.77 | U4.14 28.26,27.74 27.81,28.19 25.78,28.19 v25.65,28.07
  Bottom 0.305: 19.85,28.07 R3.1 21.5,29.72 24.89,29.72 25.65,28.96 v25.65,28.07
  other vias: 19.56,27.77
TX
  Top 0.305: U3.1 14.32,13.43 14.61,13.72 14.61,15.71 R27.1
VO
  Top 0.305: TM1.2 42.93,37.97 JP7.3

### Text on the board
tPlace: L- L+ D7 D6 D5 D4 D3 D2 D1 D0 E RW RS V0 VDD VSS | 16 | 1 | Reset | BrewPi | Asbjørn | Mejnertsen | 04 2015 | 1 | 2 | 3 | 4 | RX | TX | 5v | Door | OneWire